# Altium schematic sheet 05-LogicOR.SchDoc
size A4; DocumentNumber: 5; SheetNumber: 5; SheetTotal: 26
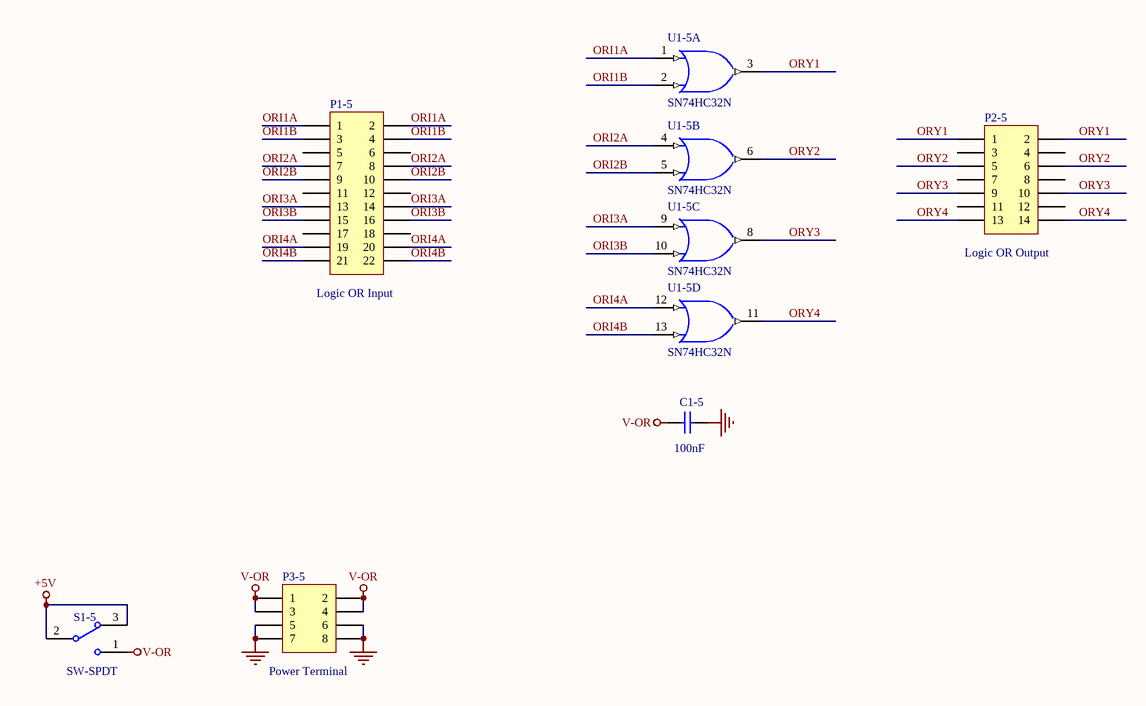
[diagram p0: 05-LogicOR.SchDoc]

## Parts
C1-5  value 100nF  [c-0805]  (hidden comment: 104)
P1-5  value Logic OR Input  [JP2.54-F-2x11A]  (hidden comment: Header 11X2)
P2-5  value Logic OR Output  [JP2.54-F-2x07A]  (hidden comment: H7X2)
P3-5  Publisher: Power Terminal  [JP2.54-F-2x04A]  (hidden comment: Header 4X2)
S1-5  SW-SPDT  [SW-SLIDE-2P-2W]
U1-5  SN74HC32N  [SK-DIP14-300]  (parts A,B,C,D of 4)

## Nets
+5V: S1-5.2 S1-5.3
GND: C1-5.2 P3-5.5 P3-5.6 P3-5.7 P3-5.8 U1-5.7(GND)
V-OR: C1-5.1 P3-5.1 P3-5.2 P3-5.3 P3-5.4 S1-5.1
VCC: U1-5.14(V-OR)
ORI1A: P1-5.1 P1-5.2 U1-5.1(A)
ORI1B: P1-5.3 P1-5.4 U1-5.2(B)
ORI2A: P1-5.7 P1-5.8 U1-5.4(A)
ORI2B: P1-5.9 P1-5.10 U1-5.5(B)
ORI3A: P1-5.13 P1-5.14 U1-5.9(A)
ORI3B: P1-5.15 P1-5.16 U1-5.10(B)
ORI4A: P1-5.19 P1-5.20 U1-5.12(A)
ORI4B: P1-5.21 P1-5.22 U1-5.13(B)
ORY1: P2-5.1 P2-5.2 U1-5.3(Y)
ORY2: P2-5.5 P2-5.6 U1-5.6(Y)
ORY3: P2-5.9 P2-5.10 U1-5.8(Y)
ORY4: P2-5.13 P2-5.14 U1-5.11(Y)

Not connected (* = marked no-connect by the designer): P1-5 5 6 11 12 17 18; P2-5 3 4 7 8 11 12

## Library data of the parts
C1-5 = Cap: Capacitor; Published: 8-Jun-2000; LatestRevisionDate: 17-Jul-2002; LatestRevisionNote: Re-released for DXP Platform.; PackageReference: RAD-0.3; Publisher: Altium Limited; PackageDescription: Radial Cap, Thru-Hole; 2 Leads; 0.3 in Pin Spacing
P1-5 = Header 11X2: Header, 11-Pin, Dual row; LatestRevisionDate: 17-Jul-2002; LatestRevisionNote: Re-released for DXP Platform.
P2-5 = Header 7X2: Header, 7-Pin, Dual row; LatestRevisionDate: 17-Jul-2002; LatestRevisionNote: Re-released for DXP Platform.
P3-5 = Header 4X2: Header, 4-Pin, Dual row; LatestRevisionDate: 17-Jul-2002; LatestRevisionNote: Re-released for DXP Platform.
S1-5 = SW-SPDT: SPDT Subminiature Toggle Switch, Right Angle Mounting, Vertical Actuation; Published: 24-Mar-1999; LatestRevisionDate: 17-Dec-2003; LatestRevisionNote: Schematic revised, PCB Footprint replaced.; DatasheetVersion: 05-Dec-2000; PackageReference: TL36WW15050; Publisher: Altium Limited; PackageDescription: Switch; 4 Leads; ComponentLink1Description: Manufacturer Link; ComponentLink1URL: http://www.apem.com
U1-5 = SN74HC32N: Quadruple 2-Input Positive-OR Gate; Published: 8-Jun-2000; LatestRevisionDate: 04-Mar-2005; LatestRevisionNote: Stylized 3D Model Added.; DatasheetVersion: May-1997; PackageVersion: Oct-1995; PackageReference: N014; Publisher: Altium Limited; PackageDescription: DIP; 14 Leads; Row Spacing 7.62 mm; Pitch 2.54 mm; ComponentLink1Description: Manufacturer Link; ComponentLink1URL: http://www.ti.com/; ComponentLink2Description: Datasheet; ComponentLink2URL: http://www-s.ti.com/sc/ds/sn74hc32.pdf